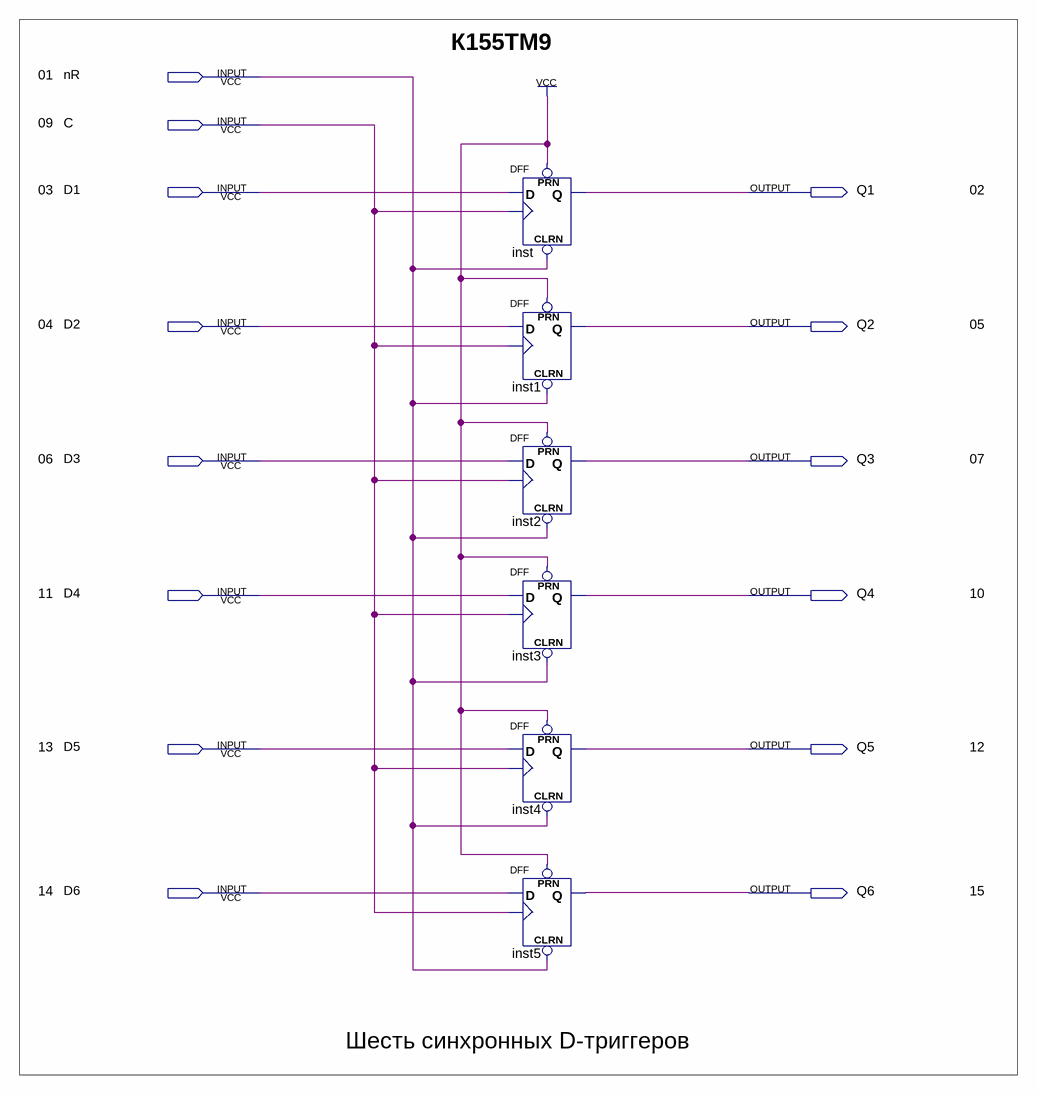
[diagram p0: schematic sheet]
// Quartus schematic K155TM9.bdf as structural Verilog: 6 symbols, 14 pins
module K155TM9 (
  input  nR,
  input  C,
  input  D1,
  input  D2,
  input  D3,
  input  D4,
  input  D5,
  input  D6,
  output Q1,
  output Q2,
  output Q3,
  output Q4,
  output Q5,
  output Q6
);

  DFF inst (.CLRN(nR), .CLK(C), .D(D1), .PRN(1'b1), .Q(Q1));
  DFF inst1 (.CLRN(nR), .CLK(C), .D(D2), .PRN(1'b1), .Q(Q2));
  DFF inst2 (.CLRN(nR), .CLK(C), .D(D3), .PRN(1'b1), .Q(Q3));
  DFF inst3 (.CLRN(nR), .CLK(C), .D(D4), .PRN(1'b1), .Q(Q4));
  DFF inst4 (.CLRN(nR), .CLK(C), .D(D5), .PRN(1'b1), .Q(Q5));
  DFF inst5 (.CLRN(nR), .CLK(C), .D(D6), .PRN(1'b1), .Q(Q6));

  // Notes on the sheet:
  //   К155ТМ9
  //   01
  //   09
  //   03
  //   02
  //   04
  //   05
  //   06
  //   07
  //   11
  //   10
  //   13
  //   12
  //   14
  //   15
  //   Шесть синхронных D-триггеров
endmodule
